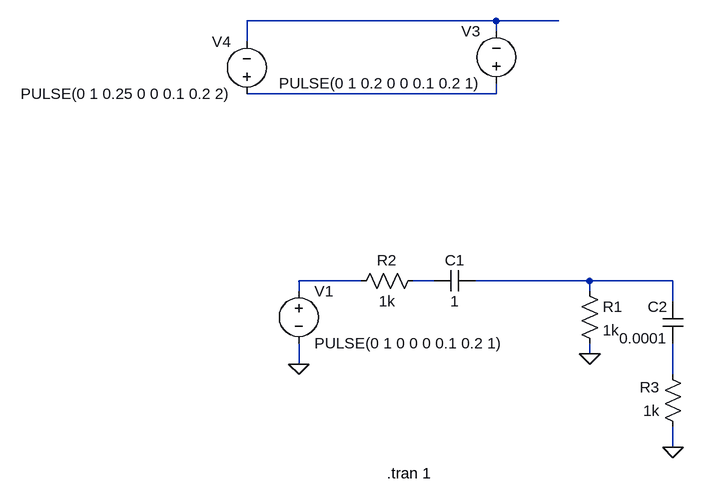
[diagram p0: schematic 2-Cap Neuron Design.asc]
2-Cap Neuron Design.asc, the LTspice schematic file:
Version 4
SHEET 1 880 680
WIRE 528 -112 144 -112
WIRE 624 -112 528 -112
WIRE 528 -96 528 -112
WIRE 144 -80 144 -112
WIRE 528 0 528 -16
WIRE 528 0 144 0
WIRE 320 288 224 288
WIRE 432 288 400 288
WIRE 672 288 496 288
WIRE 800 288 672 288
WIRE 224 304 224 288
WIRE 672 304 672 288
WIRE 800 320 800 288
WIRE 672 400 672 384
WIRE 224 416 224 384
WIRE 800 432 800 384
WIRE 800 544 800 512
FLAG 224 416 0
FLAG 672 400 0
FLAG 800 544 0
SYMBOL voltage 224 288 R0
SYMATTR InstName V1
SYMATTR Value PULSE(0 1 0 0 0 0.1 0.2 1)
SYMBOL cap 496 272 R90
WINDOW 0 0 32 VBottom 2
WINDOW 3 32 32 VTop 2
SYMATTR InstName C1
SYMATTR Value 1
SYMATTR SpiceLine Rser=1
SYMBOL voltage 528 0 R180
WINDOW 0 24 96 Left 2
WINDOW 3 24 16 Left 2
SYMATTR InstName V3
SYMATTR Value PULSE(0 1 0.2 0 0 0.1 0.2 1)
SYMATTR SpiceLine Rser=1meg
SYMBOL voltage 144 16 R180
WINDOW 0 24 96 Left 2
WINDOW 3 24 16 Left 2
SYMATTR InstName V4
SYMATTR Value PULSE(0 1 0.25 0 0 0.1 0.2 2)
SYMATTR SpiceLine Rser=1meg
SYMBOL res 416 272 R90
WINDOW 0 0 56 VBottom 2
WINDOW 3 32 56 VTop 2
SYMATTR InstName R2
SYMATTR Value 1k
SYMBOL res 656 288 R0
SYMATTR InstName R1
SYMATTR Value 1k
SYMBOL cap 816 384 R180
WINDOW 0 24 56 Left 2
WINDOW 3 24 8 Left 2
SYMATTR InstName C2
SYMATTR Value 0.0001
SYMBOL res 816 528 R180
WINDOW 0 36 76 Left 2
WINDOW 3 36 40 Left 2
SYMATTR InstName R3
SYMATTR Value 1k
TEXT 360 584 Left 2 !.tran 1

The netlist it stands for:
* 2-Cap Neuron Design.asc
V1 N003 0 PULSE(0 1 0 0 0 0.1 0.2 1)
C1 N005 N004 1 Rser=1
V3 N002 N001 PULSE(0 1 0.2 0 0 0.1 0.2 1) Rser=1meg
V4 N002 N001 PULSE(0 1 0.25 0 0 0.1 0.2 2) Rser=1meg
R2 N004 N003 1k
R1 N005 0 1k
C2 N006 N005 0.0001
R3 0 N006 1k
.tran 1
.backanno
.end